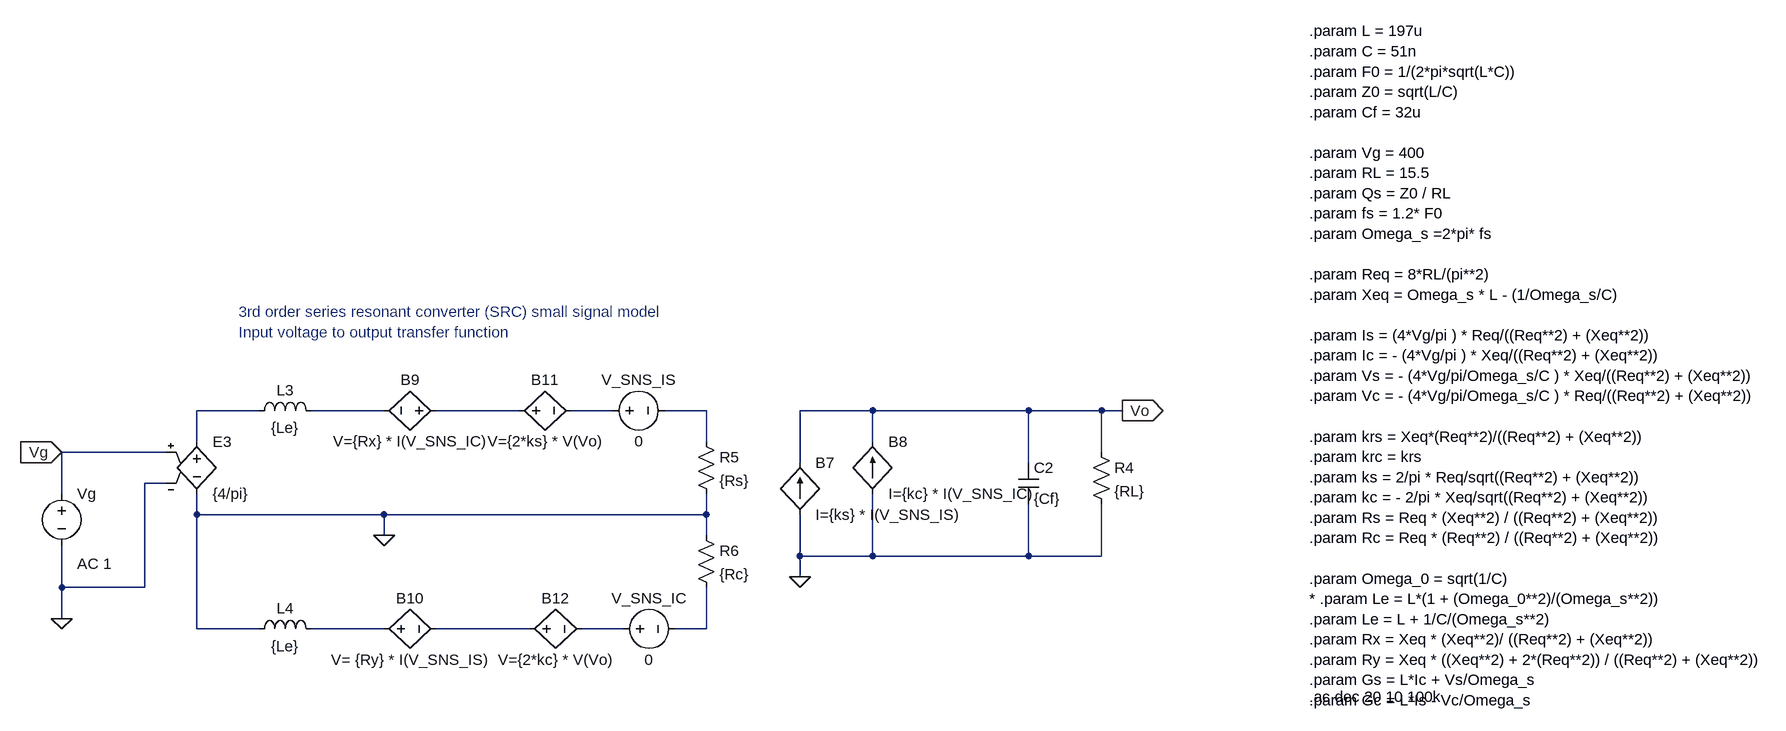
[diagram p0: schematic src_3rd_eq_vo-vg.asc]
src_3rd_eq_vo-vg.asc, the LTspice schematic file:
Version 4
SHEET 1 1852 1360
WIRE -464 336 -560 336
WIRE -272 336 -384 336
WIRE -64 336 -192 336
WIRE 80 336 16 336
WIRE 224 336 160 336
WIRE 480 336 368 336
WIRE 720 336 480 336
WIRE 832 336 720 336
WIRE 864 336 832 336
WIRE -560 384 -560 336
WIRE 224 384 224 336
WIRE 480 384 480 336
WIRE -608 400 -768 400
WIRE 832 400 832 336
WIRE 368 416 368 336
WIRE 720 416 720 336
WIRE -608 448 -640 448
WIRE -768 464 -768 400
WIRE -560 496 -560 464
WIRE -272 496 -560 496
WIRE 224 496 224 464
WIRE 224 496 -272 496
WIRE -272 528 -272 496
WIRE 224 528 224 496
WIRE 368 560 368 496
WIRE 480 560 480 464
WIRE 480 560 368 560
WIRE 720 560 720 480
WIRE 720 560 480 560
WIRE 832 560 832 480
WIRE 832 560 720 560
WIRE 368 592 368 560
WIRE -768 608 -768 544
WIRE -640 608 -640 448
WIRE -640 608 -768 608
WIRE -768 656 -768 608
WIRE -560 672 -560 496
WIRE -464 672 -560 672
WIRE -272 672 -384 672
WIRE -48 672 -192 672
WIRE 96 672 32 672
WIRE 224 672 224 608
WIRE 224 672 176 672
FLAG -272 528 0
FLAG -768 656 0
FLAG 368 592 0
FLAG 864 336 Vo
IOPIN 864 336 Out
FLAG -768 400 Vg
IOPIN -768 400 In
SYMBOL res 816 384 R0
SYMATTR InstName R4
SYMATTR Value {RL}
SYMBOL cap 704 416 R0
SYMATTR InstName C2
SYMATTR Value {Cf}
SYMBOL bi2 368 416 R0
SYMATTR InstName B7
SYMATTR Value I={ks} * I(V_SNS_IS)
SYMBOL bi2 480 384 R0
SYMATTR InstName B8
SYMATTR Value I={kc} * I(V_SNS_IC)
SYMBOL voltage -768 448 R0
WINDOW 123 24 124 Left 2
WINDOW 39 0 0 Left 2
SYMATTR Value2 AC 1
SYMATTR InstName Vg
SYMATTR Value ""
SYMBOL e -560 368 R0
SYMATTR InstName E3
SYMATTR Value {4/pi}
SYMBOL ind -480 352 R270
WINDOW 0 32 56 VTop 2
WINDOW 3 5 56 VBottom 2
SYMATTR InstName L3
SYMATTR Value {Le}
SYMBOL bv -176 336 R90
WINDOW 0 -32 56 VBottom 2
WINDOW 3 32 56 VTop 2
SYMATTR InstName B9
SYMATTR Value V={Rx} * I(V_SNS_IC)
SYMBOL ind -480 688 R270
WINDOW 0 32 56 VTop 2
WINDOW 3 5 56 VBottom 2
SYMATTR InstName L4
SYMATTR Value {Le}
SYMBOL bv -288 672 R270
WINDOW 0 32 56 VTop 2
WINDOW 3 -32 56 VBottom 2
SYMATTR InstName B10
SYMATTR Value V= {Ry} * I(V_SNS_IS)
SYMBOL res 208 368 R0
SYMATTR InstName R5
SYMATTR Value {Rs}
SYMBOL res 208 512 R0
SYMATTR InstName R6
SYMATTR Value {Rc}
SYMBOL voltage 80 672 R270
WINDOW 0 32 56 VTop 2
WINDOW 3 -32 56 VBottom 2
SYMATTR InstName V_SNS_IC
SYMATTR Value 0
SYMBOL voltage 64 336 R270
WINDOW 0 32 56 VTop 2
WINDOW 3 -32 56 VBottom 2
SYMATTR InstName V_SNS_IS
SYMATTR Value 0
SYMBOL bv -80 336 R270
WINDOW 0 32 56 VTop 2
WINDOW 3 -32 56 VBottom 2
SYMATTR InstName B11
SYMATTR Value V={2*ks} * V(Vo)
SYMBOL bv -64 672 R270
WINDOW 0 32 56 VTop 2
WINDOW 3 -32 56 VBottom 2
SYMATTR InstName B12
SYMATTR Value V={2*kc} * V(Vo)
TEXT 1152 -248 Left 2 !.param L = 197u\n.param C = 51n\n.param F0 = 1/(2*pi*sqrt(L*C))\n.param Z0 = sqrt(L/C)\n.param Cf = 32u\n \n.param Vg = 400\n.param RL = 15.5\n.param Qs = Z0 / RL\n.param fs = 1.2* F0\n.param Omega_s =2*pi* fs\n \n.param Req = 8*RL/(pi**2)\n.param Xeq = Omega_s * L - (1/Omega_s/C)\n \n.param Is = (4*Vg/pi ) * Req/((Req**2) + (Xeq**2))\n.param Ic = - (4*Vg/pi ) * Xeq/((Req**2) + (Xeq**2))\n.param Vs = - (4*Vg/pi/Omega_s/C ) * Xeq/((Req**2) + (Xeq**2))\n.param Vc = - (4*Vg/pi/Omega_s/C ) * Req/((Req**2) + (Xeq**2))\n \n.param krs = Xeq*(Req**2)/((Req**2) + (Xeq**2))\n.param krc = krs\n.param ks = 2/pi * Req/sqrt((Req**2) + (Xeq**2))\n.param kc = - 2/pi * Xeq/sqrt((Req**2) + (Xeq**2))\n.param Rs = Req * (Xeq**2) / ((Req**2) + (Xeq**2))\n.param Rc = Req * (Req**2) / ((Req**2) + (Xeq**2))\n \n.param Omega_0 = sqrt(1/C)\n* .param Le = L*(1 + (Omega_0**2)/(Omega_s**2))\n.param Le = L + 1/C/(Omega_s**2)\n.param Rx = Xeq * (Xeq**2)/ ((Req**2) + (Xeq**2))\n.param Ry = Xeq * ((Xeq**2) + 2*(Req**2)) / ((Req**2) + (Xeq**2))\n.param Gs = L*Ic + Vs/Omega_s\n.param Gc = L*Is - Vc/Omega_s
TEXT 1152 776 Left 2 !.ac dec 20 10 100k
TEXT -496 184 Left 2 ;3rd order series resonant converter (SRC) small signal model\nInput voltage to output transfer function

The netlist it stands for:
* src_3rd_eq_vo-vg.asc
R4 Vo 0 {RL}
C2 Vo 0 {Cf}
B7 0 Vo I={ks} * I(V_SNS_IS)
B8 0 Vo I={kc} * I(V_SNS_IC)
Vg Vg 0 AC 1
E3 N001 0 Vg 0 {4/pi}
L3 N001 N002 {Le}
B9 N003 N002 V={Rx} * I(V_SNS_IC)
L4 0 N006 {Le}
B10 N006 N007 V= {Ry} * I(V_SNS_IS)
R5 N005 0 {Rs}
R6 0 N009 {Rc}
V_SNS_IC N008 N009 0
V_SNS_IS N004 N005 0
B11 N003 N004 V={2*ks} * V(Vo)
B12 N007 N008 V={2*kc} * V(Vo)
.param L = 197u
.param C = 51n
.param F0 = 1/(2*pi*sqrt(L*C))
.param Z0 = sqrt(L/C)
.param Cf = 32u
.param Vg = 400
.param RL = 15.5
.param Qs = Z0 / RL
.param fs = 1.2* F0
.param Omega_s =2*pi* fs
.param Req = 8*RL/(pi**2)
.param Xeq = Omega_s * L - (1/Omega_s/C)
.param Is = (4*Vg/pi ) * Req/((Req**2) + (Xeq**2))
.param Ic = - (4*Vg/pi ) * Xeq/((Req**2) + (Xeq**2))
.param Vs = - (4*Vg/pi/Omega_s/C ) * Xeq/((Req**2) + (Xeq**2))
.param Vc = - (4*Vg/pi/Omega_s/C ) * Req/((Req**2) + (Xeq**2))
.param krs = Xeq*(Req**2)/((Req**2) + (Xeq**2))
.param krc = krs
.param ks = 2/pi * Req/sqrt((Req**2) + (Xeq**2))
.param kc = - 2/pi * Xeq/sqrt((Req**2) + (Xeq**2))
.param Rs = Req * (Xeq**2) / ((Req**2) + (Xeq**2))
.param Rc = Req * (Req**2) / ((Req**2) + (Xeq**2))
.param Omega_0 = sqrt(1/C)
* .param Le = L*(1 + (Omega_0**2)/(Omega_s**2))
.param Le = L + 1/C/(Omega_s**2)
.param Rx = Xeq * (Xeq**2)/ ((Req**2) + (Xeq**2))
.param Ry = Xeq * ((Xeq**2) + 2*(Req**2)) / ((Req**2) + (Xeq**2))
.param Gs = L*Ic + Vs/Omega_s
.param Gc = L*Is - Vc/Omega_s
.ac dec 20 10 100k
* 3rd order series resonant converter (SRC) small signal model
* Input voltage to output transfer function
.backanno
.end